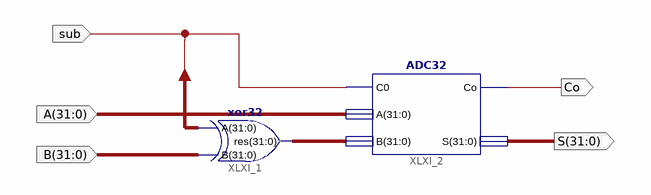
[diagram p0: schematic sheet 1]
// Xilinx ISE schematic ABC32.sch (kintex7) as structural Verilog: 2 symbols, 5 ports
module ABC32 (
  input  [31:0] B,
  input  sub,
  input  [31:0] A,
  output [31:0] S,
  output Co
);

  wire [31:0] XLXN_5;

  xor32 XLXI_1 (.A({32{sub}}), .B(B), .res(XLXN_5));
  ADC32 XLXI_2 (.C0(sub), .A(A), .B(XLXN_5), .Co(Co), .S(S));
endmodule
